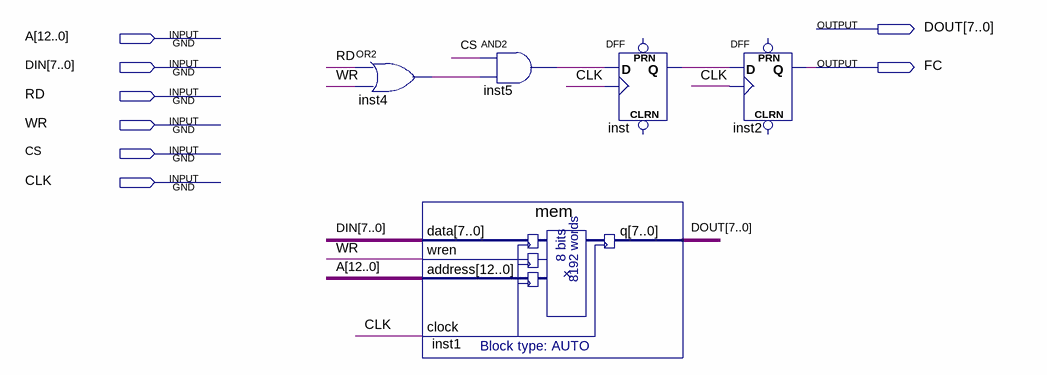
[diagram p0: schematic sheet]
// Quartus schematic mem_controller.bdf as structural Verilog: 5 symbols, 8 pins
module mem_controller (
  input  [12:0] A,
  input  [7:0] DIN,
  input  RD,
  input  WR,
  input  CS,
  input  CLK,
  output [7:0] DOUT,
  output FC
);

  wire inst4_out, inst5_out, inst_q;

  or inst4 (inst4_out, RD, WR);
  mem inst1 (.data(DIN), .wren(WR), .address(A), .clock(CLK), .q(DOUT));
  and inst5 (inst5_out, CS, inst4_out);
  DFF inst (.CLK(CLK), .D(inst5_out), .Q(inst_q));  // open: CLRN, PRN
  DFF inst2 (.CLK(CLK), .D(inst_q), .Q(FC));  // open: CLRN, PRN
endmodule
